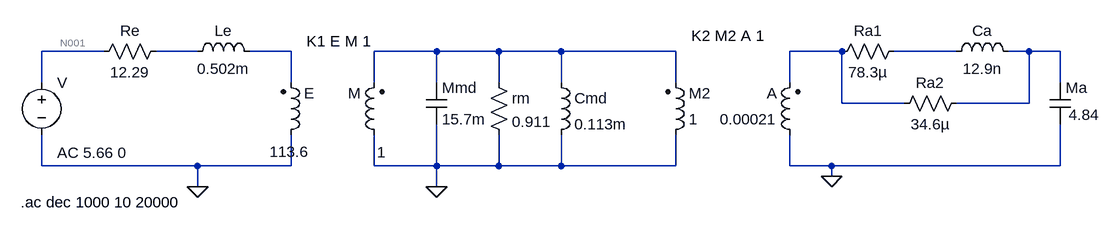
[diagram p0: schematic ex4_Falante_acoplamento_eldireto.asc]
ex4_Falante_acoplamento_eldireto.asc, the LTspice schematic file:
Version 4
SHEET 1 1572 680
WIRE 32 64 -64 64
WIRE 176 64 112 64
WIRE 320 64 256 64
WIRE 544 64 448 64
WIRE 640 64 544 64
WIRE 736 64 640 64
WIRE 912 64 736 64
WIRE 1168 64 1088 64
WIRE 1344 64 1248 64
WIRE 1456 64 1424 64
WIRE 1504 64 1456 64
WIRE -64 112 -64 64
WIRE 320 112 320 64
WIRE 448 112 448 64
WIRE 544 112 544 64
WIRE 640 112 640 64
WIRE 736 112 736 64
WIRE 912 112 912 64
WIRE 1088 112 1088 64
WIRE 1504 112 1504 64
WIRE 1168 144 1168 64
WIRE 1264 144 1168 144
WIRE 1456 144 1456 64
WIRE 1456 144 1344 144
WIRE -64 240 -64 192
WIRE 176 240 -64 240
WIRE 320 240 320 192
WIRE 320 240 176 240
WIRE 448 240 448 192
WIRE 544 240 544 176
WIRE 544 240 448 240
WIRE 640 240 640 192
WIRE 640 240 544 240
WIRE 736 240 736 192
WIRE 736 240 640 240
WIRE 912 240 912 192
WIRE 912 240 736 240
WIRE 1088 240 1088 192
WIRE 1152 240 1088 240
WIRE 1504 240 1504 176
WIRE 1504 240 1152 240
WIRE 1152 256 1152 240
WIRE 176 272 176 240
WIRE 544 272 544 240
FLAG 176 272 0
FLAG 544 272 0
FLAG 1152 256 0
SYMBOL voltage -64 96 R0
WINDOW 123 24 124 Left 2
WINDOW 39 0 0 Left 0
SYMATTR Value2 AC 5.66 0
SYMATTR InstName V
SYMATTR Value ""
SYMBOL res 128 48 R90
WINDOW 0 0 56 VBottom 2
WINDOW 3 32 56 VTop 2
SYMATTR InstName Re
SYMATTR Value 12.29
SYMBOL ind 160 80 R270
WINDOW 0 32 56 VTop 2
WINDOW 3 5 56 VBottom 2
SYMATTR InstName Le
SYMATTR Value 0.502m
SYMBOL ind2 304 208 M180
WINDOW 0 36 80 Left 2
WINDOW 3 -17 -10 Left 2
SYMATTR InstName E
SYMATTR Value 113.6
SYMBOL ind2 464 208 R180
WINDOW 0 36 80 Left 2
WINDOW 3 -2 -11 Left 2
SYMATTR InstName M
SYMATTR Value 1
SYMBOL cap 528 112 R0
SYMATTR InstName Mmd
SYMATTR Value 15.7m
SYMBOL res 624 96 R0
SYMATTR InstName rm
SYMATTR Value 0.911
SYMBOL ind 720 96 R0
SYMATTR InstName Cmd
SYMATTR Value 0.113m
SYMBOL ind2 896 208 M180
WINDOW 0 36 80 Left 2
WINDOW 3 36 40 Left 2
SYMATTR InstName M2
SYMATTR Value 1
SYMBOL ind2 1104 208 R180
WINDOW 0 36 80 Left 2
WINDOW 3 36 40 Left 2
SYMATTR InstName A
SYMATTR Value 0.00021
SYMBOL cap 1488 112 R0
WINDOW 3 29 49 Left 2
SYMATTR Value 4.84
SYMATTR InstName Ma
SYMBOL res 1264 48 R90
WINDOW 0 0 56 VBottom 2
WINDOW 3 32 56 VTop 2
SYMATTR InstName Ra1
SYMATTR Value 78.3µ
SYMBOL ind 1328 80 R270
WINDOW 0 32 56 VTop 2
WINDOW 3 5 56 VBottom 2
SYMATTR InstName Ca
SYMATTR Value 12.9n
SYMBOL res 1360 128 R90
WINDOW 0 0 56 VBottom 2
WINDOW 3 32 56 VTop 2
SYMATTR InstName Ra2
SYMATTR Value 34.6µ
TEXT 344 48 Left 2 !K1 E M 1
TEXT 936 40 Left 2 !K2 M2 A 1
TEXT -96 296 Left 2 !.ac dec 1000 10 20000

The netlist it stands for:
* ex4_Falante_acoplamento_eldireto.asc
V N001 0 AC 5.66 0
Re N002 N001 12.29
Le N002 N003 0.502m
L§E 0 N003 113.6
L§M 0 N004 1
C§Mmd N004 0 15.7m
rm N004 0 0.911
L§Cmd N004 0 0.113m
L§M2 0 N004 1
L§A 0 N005 0.00021
C§Ma N007 0 4.84
Ra1 N006 N005 78.3µ
L§Ca N006 N007 12.9n
Ra2 N007 N005 34.6µ
K1 E M 1
K2 M2 A 1
.ac dec 1000 10 20000
.backanno
.end

* Results of the author's LTspice run, read from the files saved beside the schematic
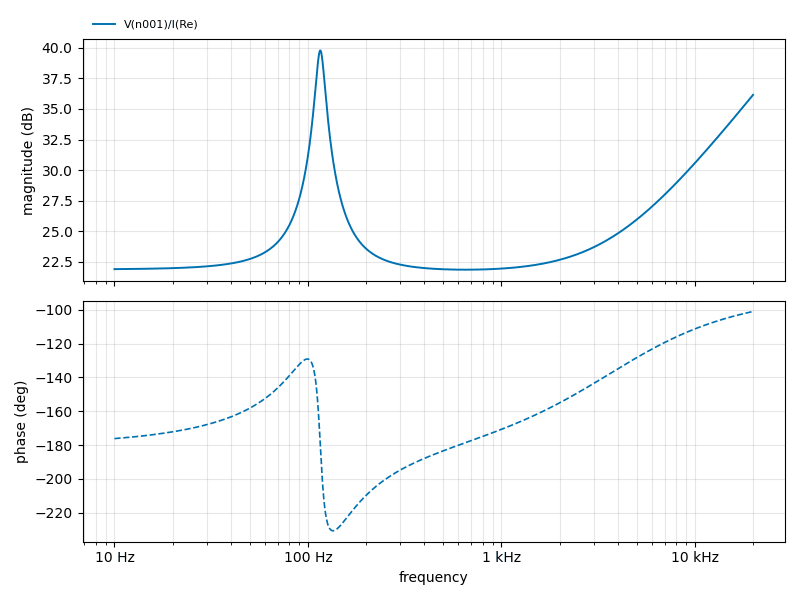
[diagram p1: AC Analysis of ex4_Falante_acoplamento_eldireto.asc, plotted from the saved traces]
* AC Analysis, 1 run:
*   V(n001)/I(Re): 21.90 dB at 10 Hz, 36.16 dB at 20 kHz, peak 39.79 dB at 115.9 Hz, 3 dB below the peak at 109.6 Hz and 122.5 Hz